# Altium schematic sheet Sheet2.SchDoc
size A4
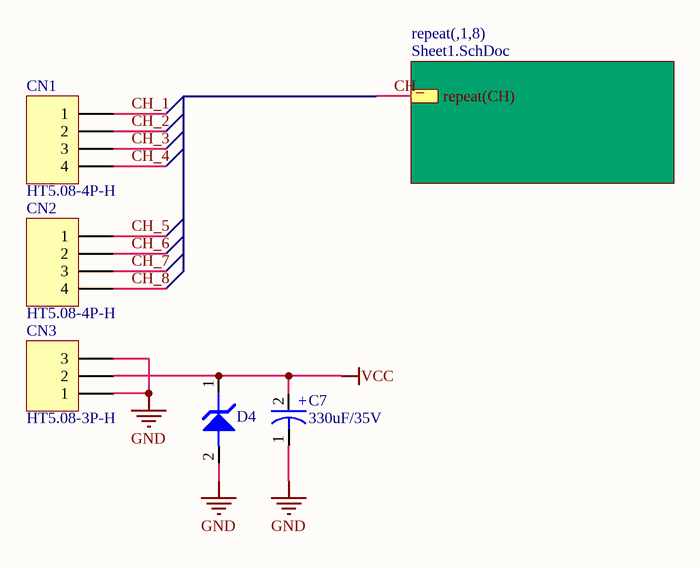
[diagram p0: Sheet2.SchDoc]

## Parts
C7  value 330uF/35V  [CA10X16P5]  (hidden comment: CAPACITOR 330uF 20% 35V 10mmX16mm)
CN1  HT5.08-4P-H  [HT5.08-4P-H]
CN2  HT5.08-4P-H  [HT5.08-4P-H]
CN3  HT5.08-3P-H  [HT5.08-3P-H]
D4  SMAJ5.0A  [SMA]  (value not drawn)

## Sub-sheets
repeat(,1,8) = Sheet1.SchDoc: repeat(CH)

## Nets
GND: C7.1 CN3.1 CN3.3 D4.2
VCC: C7.2 CN3.2 D4.1
CH_: sheet repeat(,1,8)/repeat(CH)
CH_1: CN1.1
CH_2: CN1.2
CH_3: CN1.3
CH_4: CN1.4
CH_5: CN2.1
CH_6: CN2.2
CH_7: CN2.3
CH_8: CN2.4

## Notes on the sheet
- (in symbol EC00095) +

## Library data of the parts
C7 = EC00095: CAP 35V 20% 330uF 10X16X0.6MM ROHS，7000hours; Manufacturer: NIPPON CHEMI-CON; Manufacturer P/N: EKY350ELL331MJ16S; ID: 95; Type: ****; HelpURL: \\192.168.1.3\Esh\Department\RD\CAD\Component\Capacitor\KY(105).pdf; P/N: EC00095
CN1 CN2 = Header 4: Header, 4-Pin; Manufacturer P/N: HT5.08-4 Bend; P/N: EE00005; Manufacturer: *
CN3 = Header 3: Header, 3-Pin; LatestRevisionDate: 17-Jul-2002; LatestRevisionNote: Re-released for DXP Platform.; Publisher: Altium Limited
D4 = ED00032: Manufacturer P/N: SMBJ15A; Manufacturer: Bourns; P/N: EE00002; Value: SMBJ15A; Type: ****